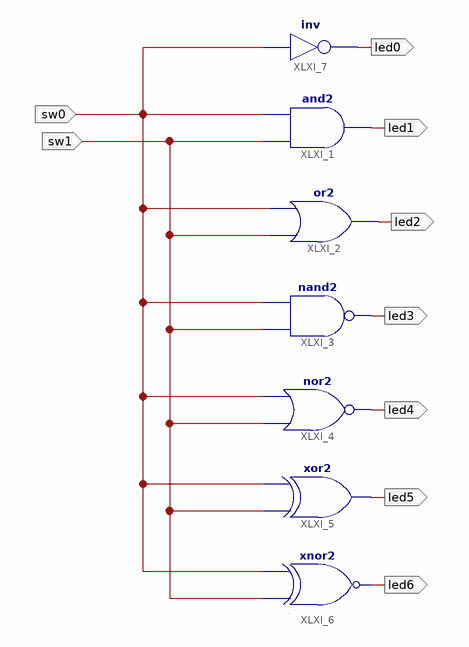
[diagram p0: schematic sheet 1]
// Xilinx ISE schematic logikai_kapuk.sch (artix7) as structural Verilog: 7 symbols, 9 ports
module logikai_kapuk (
  input  sw1,
  input  sw0,
  output led0,
  output led1,
  output led2,
  output led3,
  output led4,
  output led5,
  output led6
);

  and XLXI_1 (led1, sw1, sw0);
  or XLXI_2 (led2, sw1, sw0);
  nand XLXI_3 (led3, sw1, sw0);
  nor XLXI_4 (led4, sw1, sw0);
  xor XLXI_5 (led5, sw1, sw0);
  xnor XLXI_6 (led6, sw1, sw0);
  not XLXI_7 (led0, sw0);
endmodule
